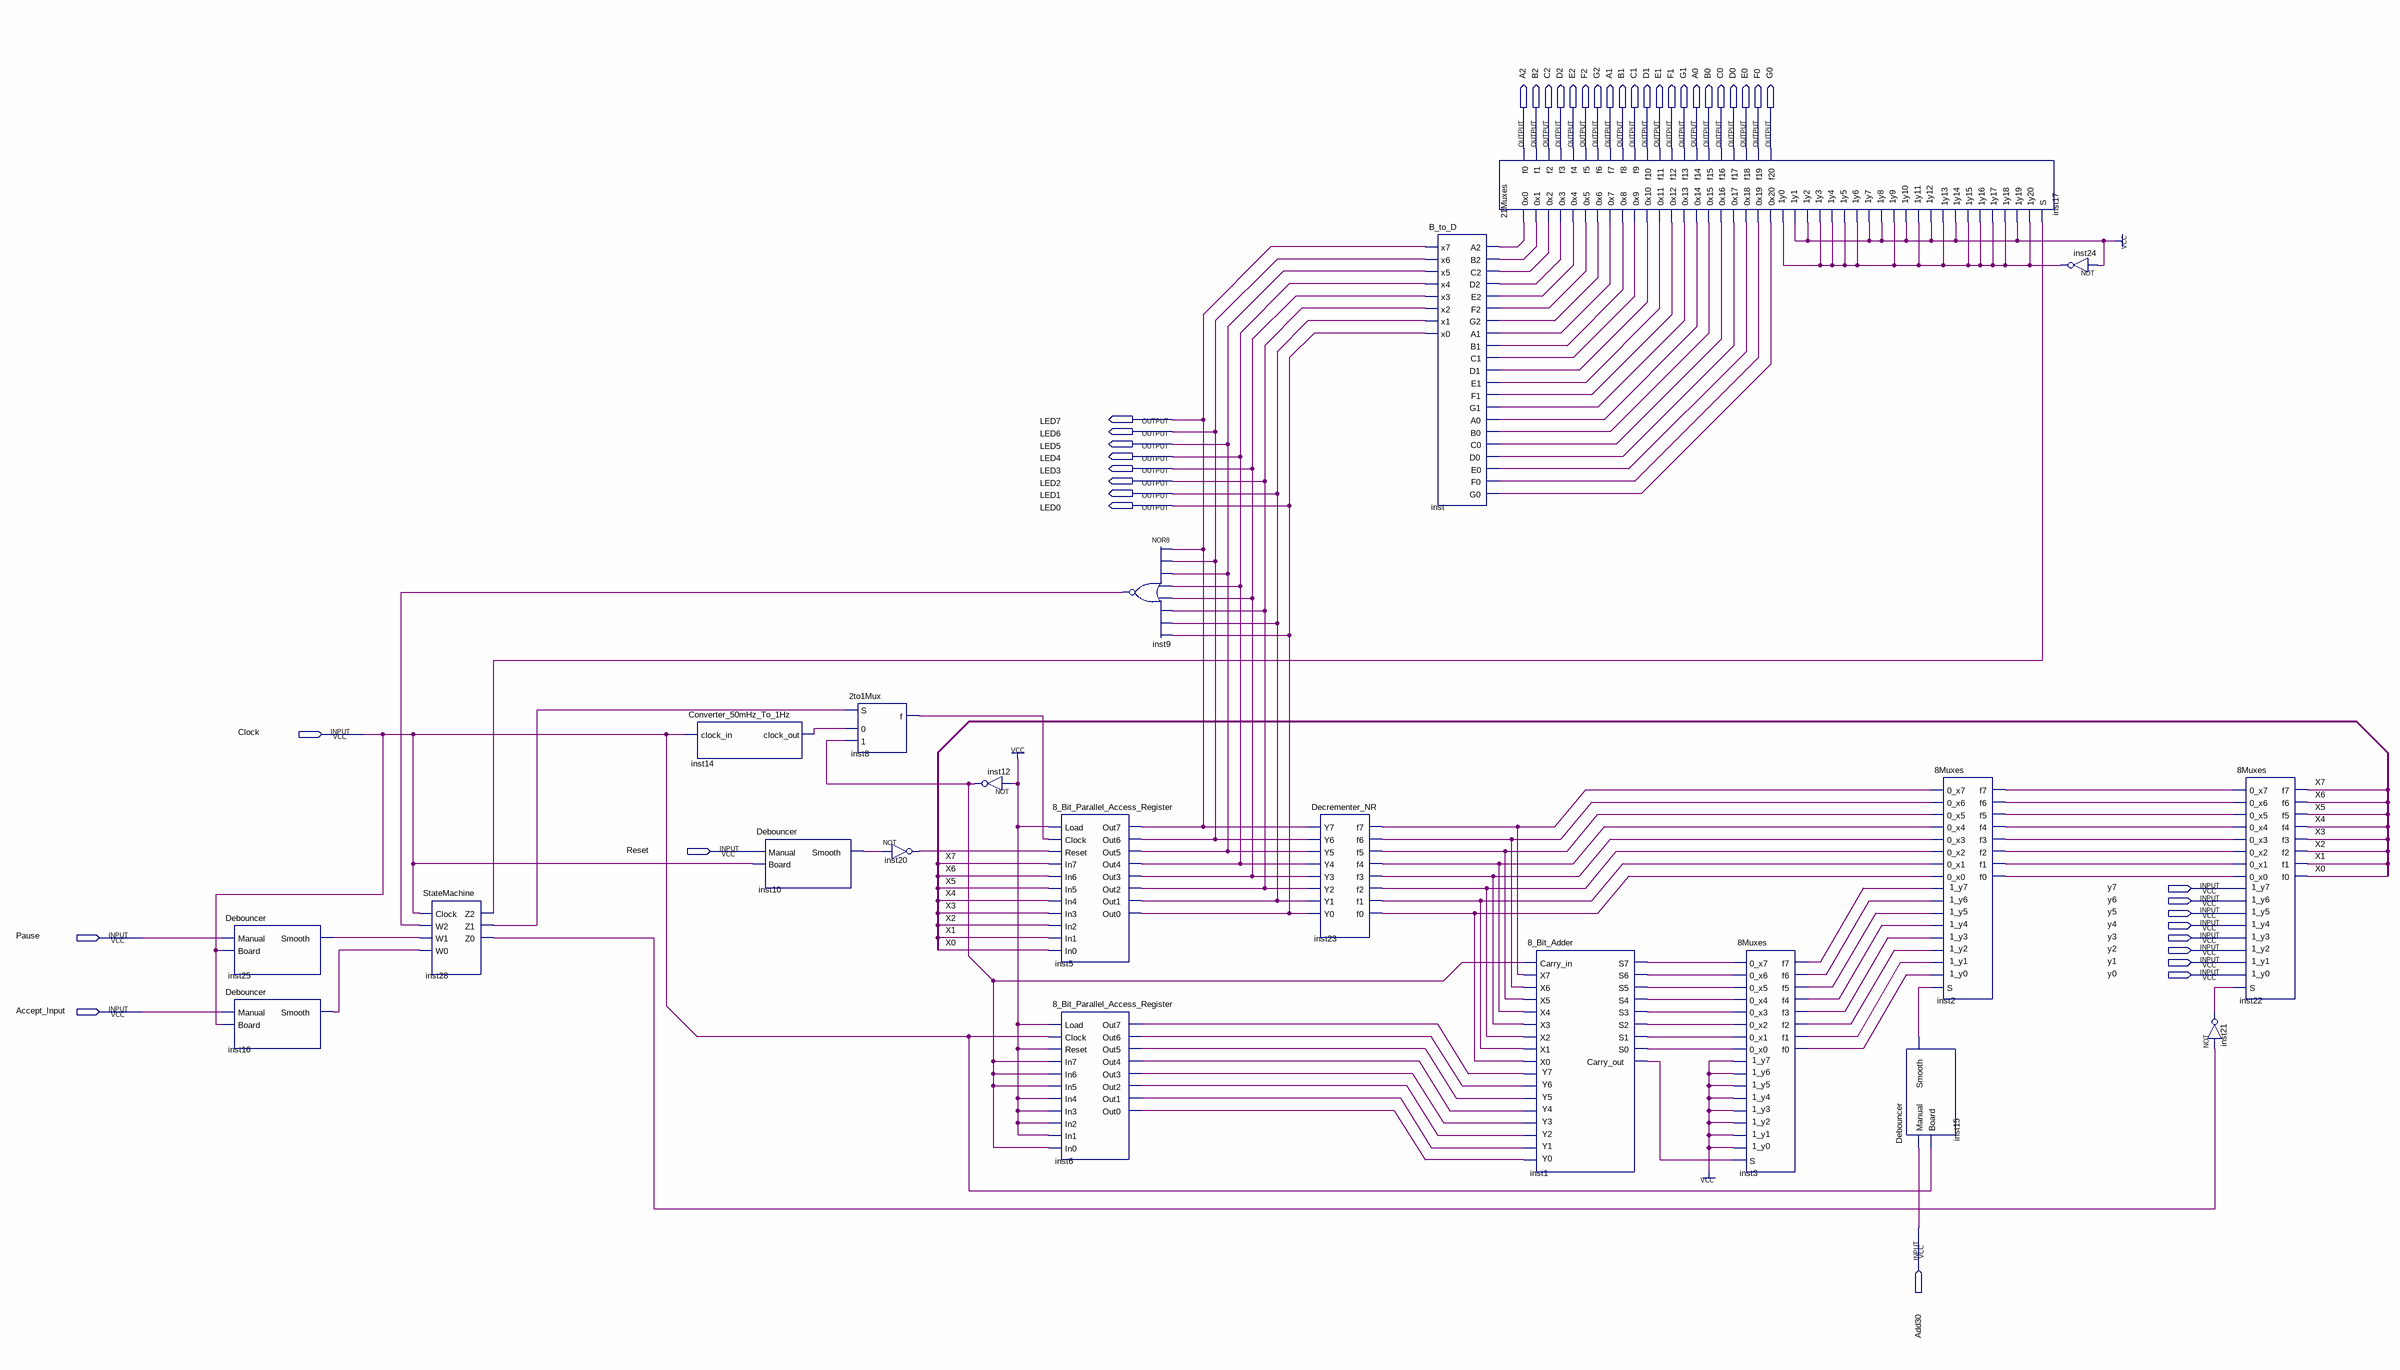
[diagram p0: schematic sheet]
// Quartus schematic Timer.bdf as structural Verilog: 21 symbols, 42 pins
module Timer (
  input  Clock,
  input  Reset,
  input  y7,
  input  y6,
  input  y5,
  input  y4,
  input  Pause,
  input  y3,
  input  y2,
  input  y1,
  input  y0,
  input  Accept_Input,
  input  Add30,
  output A2,
  output B2,
  output C2,
  output D2,
  output E2,
  output F2,
  output G2,
  output A1,
  output B1,
  output C1,
  output D1,
  output E1,
  output F1,
  output G1,
  output A0,
  output B0,
  output C0,
  output D0,
  output E0,
  output F0,
  output G0,
  output LED7,
  output LED6,
  output LED5,
  output LED4,
  output LED3,
  output LED2,
  output LED1,
  output LED0
);

  wire inst1_carry_out, inst1_s0, inst1_s1, inst1_s2, inst1_s3, inst1_s4, inst1_s5, inst1_s6, inst1_s7,
       inst2_f0, inst2_f1, inst2_f2, inst2_f3, inst2_f4, inst2_f5, inst2_f6, inst2_f7, inst3_f0, inst3_f1,
       inst3_f2, inst3_f3, inst3_f4, inst3_f5, inst3_f6, inst3_f7, inst6_out0, inst6_out1, inst6_out2,
       inst6_out3, inst6_out4, inst6_out5, inst6_out6, inst6_out7, inst8_f, inst9_out, inst10_smooth,
       inst12_out, inst14_clock_out, inst15_smooth, inst16_smooth, inst20_out, inst21_out, inst23_f0,
       inst23_f1, inst23_f2, inst23_f3, inst23_f4, inst23_f5, inst23_f6, inst23_f7, inst24_out,
       inst25_smooth, inst28_z0, inst28_z1, inst28_z2, inst_a0, inst_a1, inst_a2, inst_b0, inst_b1, inst_b2,
       inst_c0, inst_c1, inst_c2, inst_d0, inst_d1, inst_d2, inst_e0, inst_e1, inst_e2, inst_f0, inst_f1,
       inst_f2, inst_g0, inst_g1, inst_g2, X0, X1, X2, X3, X4, X5, X6, X7;

  Debouncer inst25 (.Manual(Pause), .Board(Clock), .Smooth(inst25_smooth));
  Debouncer inst16 (.Manual(Accept_Input), .Board(Clock), .Smooth(inst16_smooth));
  StateMachine inst28 (
    .Clock(Clock), .W2(inst9_out), .W1(inst25_smooth), .W0(inst16_smooth), .Z2(inst28_z2), .Z1(inst28_z1),
    .Z0(inst28_z0));
  Converter_50mHz_To_1Hz inst14 (.clock_in(Clock), .clock_out(inst14_clock_out));
  Debouncer inst10 (.Manual(Reset), .Board(Clock), .Smooth(inst10_smooth));
  \2to1Mux  inst8 (.\0 (inst14_clock_out), .S(inst28_z1), .\1 (inst12_out), .f(inst8_f));
  not inst20 (inst20_out, inst10_smooth);
  not inst12 (inst12_out, 1'b1);
  \8_Bit_Parallel_Access_Register  inst5 (
    .Load(1'b1), .Clock(inst8_f), .Reset(inst20_out), .In7(X7), .In6(X6), .In5(X5), .In4(X4), .In3(X3),
    .In2(X2), .In1(X1), .In0(X0), .Out7(LED7), .Out6(LED6), .Out5(LED5), .Out4(LED4), .Out2(LED2),
    .Out1(LED1), .Out0(LED0), .Out3(LED3));
  \8_Bit_Parallel_Access_Register  inst6 (
    .Load(1'b1), .Clock(Clock), .Reset(1'b1), .In7(inst12_out), .In6(inst12_out), .In5(inst12_out),
    .In4(1'b1), .In3(1'b1), .In2(1'b1), .In1(1'b1), .In0(inst12_out), .Out7(inst6_out7), .Out6(inst6_out6),
    .Out5(inst6_out5), .Out4(inst6_out4), .Out2(inst6_out2), .Out1(inst6_out1), .Out0(inst6_out0),
    .Out3(inst6_out3));
  nor inst9 (inst9_out, LED7, LED6, LED5, LED4, LED3, LED2, LED1, LED0);
  Decrementer_NR inst23 (
    .Y0(LED0), .Y1(LED1), .Y2(LED2), .Y3(LED3), .Y4(LED4), .Y5(LED5), .Y6(LED6), .Y7(LED7), .f0(inst23_f0),
    .f1(inst23_f1), .f2(inst23_f2), .f3(inst23_f3), .f4(inst23_f4), .f5(inst23_f5), .f6(inst23_f6),
    .f7(inst23_f7));
  B_to_D inst (
    .x0(LED0), .x1(LED1), .x2(LED2), .x3(LED3), .x4(LED4), .x5(LED5), .x6(LED6), .x7(LED7), .A2(inst_a2),
    .B2(inst_b2), .C2(inst_c2), .D2(inst_d2), .E2(inst_e2), .F2(inst_f2), .G2(inst_g2), .A1(inst_a1),
    .B1(inst_b1), .C1(inst_c1), .D1(inst_d1), .E1(inst_e1), .F1(inst_f1), .G1(inst_g1), .A0(inst_a0),
    .B0(inst_b0), .C0(inst_c0), .D0(inst_d0), .E0(inst_e0), .F0(inst_f0), .G0(inst_g0));
  \21Muxes  inst17 (
    .\0x0 (inst_a2), .\1y0 (inst24_out), .\0x1 (inst_b2), .\1y1 (1'b1), .\0x2 (inst_c2), .\1y2 (1'b1),
    .\0x3 (inst_d2), .\1y3 (inst24_out), .\0x4 (inst_e2), .\1y4 (inst24_out), .\0x5 (inst_f2),
    .\1y5 (inst24_out), .\0x6 (inst_g2), .\1y6 (inst24_out), .\0x7 (inst_a1), .\1y7 (1'b1), .\0x8 (inst_b1),
    .\1y8 (1'b1), .\0x9 (inst_c1), .\1y9 (inst24_out), .\0x10 (inst_d1), .\1y10 (1'b1), .\0x11 (inst_e1),
    .\1y11 (inst24_out), .\0x12 (inst_f1), .\1y12 (1'b1), .\0x13 (inst_g1), .\1y13 (inst24_out),
    .\0x14 (inst_a0), .\1y14 (1'b1), .\0x15 (inst_b0), .\1y15 (inst24_out), .\0x16 (inst_c0),
    .\1y16 (inst24_out), .\0x17 (inst_d0), .\1y17 (inst24_out), .\0x18 (inst_e0), .\1y18 (inst24_out),
    .\0x19 (inst_f0), .\1y19 (1'b1), .S(inst28_z2), .\0x20 (inst_g0), .\1y20 (inst24_out), .f0(A2), .f1(B2),
    .f2(C2), .f3(D2), .f4(E2), .f5(F2), .f6(G2), .f7(A1), .f8(B1), .f9(C1), .f10(D1), .f11(E1), .f12(F1),
    .f13(G1), .f14(A0), .f15(B0), .f16(C0), .f17(D0), .f18(E0), .f19(F0), .f20(G0));
  \8_Bit_Adder  inst1 (
    .Carry_in(inst12_out), .X4(inst23_f4), .X0(inst23_f0), .Y4(inst6_out4), .Y0(inst6_out0), .X1(inst23_f1),
    .X5(inst23_f5), .Y1(inst6_out1), .Y5(inst6_out5), .X2(inst23_f2), .X6(inst23_f6), .Y2(inst6_out2),
    .Y6(inst6_out6), .X3(inst23_f3), .X7(inst23_f7), .Y3(inst6_out3), .Y7(inst6_out7), .S0(inst1_s0),
    .S4(inst1_s4), .S1(inst1_s1), .S5(inst1_s5), .S2(inst1_s2), .S6(inst1_s6), .S3(inst1_s3), .S7(inst1_s7),
    .Carry_out(inst1_carry_out));
  \8Muxes  inst3 (
    .\0_x0 (inst1_s0), .\1_y0 (1'b1), .\0_x1 (inst1_s1), .\1_y1 (1'b1), .\0_x2 (inst1_s2), .\1_y2 (1'b1),
    .\0_x3 (inst1_s3), .\1_y3 (1'b1), .\0_x4 (inst1_s4), .\1_y4 (1'b1), .\0_x5 (inst1_s5), .\1_y5 (1'b1),
    .\0_x6 (inst1_s6), .\1_y6 (1'b1), .\0_x7 (inst1_s7), .S(inst1_carry_out), .\1_y7 (1'b1), .f0(inst3_f0),
    .f1(inst3_f1), .f2(inst3_f2), .f3(inst3_f3), .f4(inst3_f4), .f5(inst3_f5), .f6(inst3_f6), .f7(inst3_f7));
  Debouncer inst15 (.Manual(Add30), .Board(Clock), .Smooth(inst15_smooth));
  \8Muxes  inst2 (
    .\0_x0 (inst23_f0), .\1_y0 (inst3_f0), .\0_x1 (inst23_f1), .\1_y1 (inst3_f1), .\0_x2 (inst23_f2),
    .\1_y2 (inst3_f2), .\0_x3 (inst23_f3), .\1_y3 (inst3_f3), .\0_x4 (inst23_f4), .\1_y4 (inst3_f4),
    .\0_x5 (inst23_f5), .\1_y5 (inst3_f5), .\0_x6 (inst23_f6), .\1_y6 (inst3_f6), .\0_x7 (inst23_f7),
    .S(inst15_smooth), .\1_y7 (inst3_f7), .f0(inst2_f0), .f1(inst2_f1), .f2(inst2_f2), .f3(inst2_f3),
    .f4(inst2_f4), .f5(inst2_f5), .f6(inst2_f6), .f7(inst2_f7));
  not inst24 (inst24_out, 1'b1);
  not inst21 (inst21_out, inst28_z0);
  \8Muxes  inst22 (
    .\0_x0 (inst2_f0), .\1_y0 (y0), .\0_x1 (inst2_f1), .\1_y1 (y1), .\0_x2 (inst2_f2), .\1_y2 (y2),
    .\0_x3 (inst2_f3), .\1_y3 (y3), .\0_x4 (inst2_f4), .\1_y4 (y4), .\0_x5 (inst2_f5), .\1_y5 (y5),
    .\0_x6 (inst2_f6), .\1_y6 (y6), .\0_x7 (inst2_f7), .S(inst21_out), .\1_y7 (y7), .f0(X0), .f1(X1),
    .f2(X2), .f3(X3), .f4(X4), .f5(X5), .f6(X6), .f7(X7));
endmodule
